# Altium project sterio_mic.PrjPcb
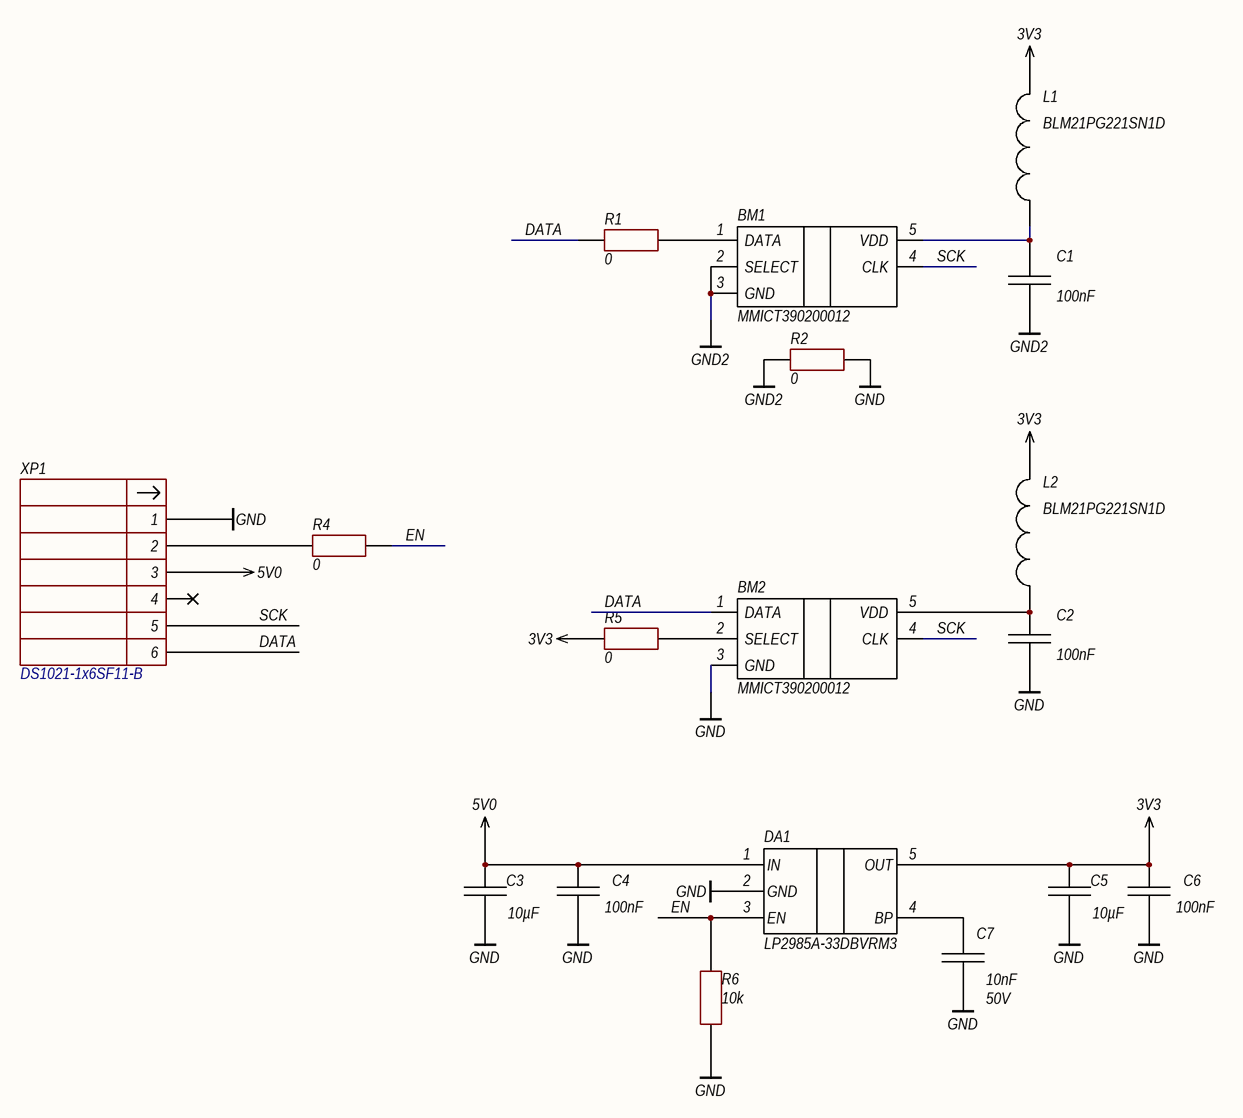
[diagram p0: sterio_mic MCU.SchDoc]
ApprovedBy: 5; Author: 1; CheckedBy: 2; NormInspection: 4; Organization: Encata; ProcessInspection: 3; ProjectNumber: 000123456; Title: Устройство; Title2str: устройство
1 sheet, 18 parts. Net scope: global (net labels, ports and power ports of the same name join across sheets).
Board file: sterio_mic PCB.PcbDoc

## Sheet sterio_mic MCU.SchDoc: Устройство
size 420 x 297 mm; DocumentNumber: 000123456 Э3; SheetNumber: 1; SheetTotal: 1; DocumentType: Схема электрическая принципиальная

### Parts
BM1  MMICT390200012  [5-Terminal LGA_CAV]
BM2  MMICT390200012  [5-Terminal LGA_CAV]
C1  Capacitance: 100nF  [CAPC0805_H0.95_N]  (hidden comment: CC0805KPX7R9BB104)
C2  Capacitance: 100nF  [CAPC0805_H0.95_N]  (hidden comment: CC0805KPX7R9BB104)
C3  Capacitance: 10µF  [CAPC0805_H1.45_N]  (hidden comment: CL21B106KOQNNNE)
C4  Capacitance: 100nF  [CAPC0805_H0.95_N]  (hidden comment: CC0805KPX7R9BB104)
C5  Capacitance: 10µF  [CAPC0805_H1.45_N]  (hidden comment: CL21B106KOQNNNE)
C6  Capacitance: 100nF  [CAPC0805_H0.95_N]  (hidden comment: CC0805KPX7R9BB104)
C7  Capacitance: 10nF  Voltage Rating: 50V  [CAPC0805_H0.95_N]  (hidden comment: CC0805JKNPO9BN103)
DA1  LP2985A-33DBVRM3  [SOT-23-5]
L1  BLM21PG221SN1D  [INDC0805_H1.25_N]
L2  BLM21PG221SN1D  [INDC0805_H1.25_N]
R1  Resistance: 0  [RESC0805_N]  (hidden comment: RC0805FR-070RL)
R2  Resistance: 0  [RESC0805_N]  (hidden comment: RC0805FR-070RL)
R4  Resistance: 0  [RESC0805_N]  (hidden comment: RC0805FR-070RL)
R5  Resistance: 0  [RESC0805_N]  (hidden comment: RC0805FR-070RL)
R6  Resistance: 10k  [RESC0805_N]  (hidden comment: RT0805BRB0710KL)
XP1  DS1021-1x6SF11-B  [PLS-6(DS-1021-1x6)]

### Nets
3V3: C5.1 C6.1 DA1.5(OUT) L1.2 L2.2 R5.1
5V0: C3.1 C4.1 DA1.1(IN) XP1.3
GND: BM2.3(GND) C2.2 C3.2 C4.2 C5.2 C6.2 C7.2 DA1.2(GND) R2.1 R6.1 XP1.1
GND2: BM1.2(SELECT) BM1.3(GND) C1.2 R2.2
DATA: BM2.1(DATA) R1.1 XP1.6
EN: DA1.3(EN) R4.1 R6.2
SCK: BM1.4(CLK) BM2.4(CLK) XP1.5
NetBM1_1: BM1.1(DATA) R1.2
NetBM1_5: BM1.5(VDD) C1.1 L1.1
NetBM2_2: BM2.2(SELECT) R5.2
NetBM2_5: BM2.5(VDD) C2.1 L2.1
NetC7_1: C7.1 DA1.4(BP)
NetR4_2: R4.2 XP1.2

Not connected (* = marked no-connect by the designer): XP1 4*

### Notes on the sheet
- Модификация
- Справ. №
- Подп. и дата
- Инв. № дубл.
- Взам. инв. №
- Разраб.
- Изм.
- Лист
- № докум.
- Подп.
- Дата
- Лит.
- Масса
- Масштаб
- Пров.
- Т.контр.
- Листов
- Инв. № подл.
- Утв.
- Н.контр.
- 2.106-A3
- Копировал
- Формат А3

### Library data of the parts
BM1 BM2 = CMP-SENS-0013-8: digital MEMS microphone; Manufacturer: TDK; Interface Type: PDM; Case/Package: LGA; Author: t.dorakh; HelpURL: https://static.chipdip.ru/lib/672/DOC011672161.pdf; Manufacturer Part Name: MMICT390200012
C1 C2 C4 C6 = CMP-CAP-CER-SMD-0001-5: 0805 100nF 50V ±10% X7R; Manufacturer: Yageo; Case Code (Metric): 2012; Dielectric: X7R; Length: 2mm; Voltage Rating: 50V; Lead Free: Yes; Series: СС; Depth: 850µm; Tolerance: 10%; Case Code (Imperial): 0805; Manufacturer Part Number: CC0805KPX7R9BB104; Case/Package: 0805; Author: m.seliadtsou; Width: 1.25mm; Height: 850µm; HelpURL: https://www.yageo.com/upload/media/product/products/datasheet/mlcc/UPY-GPHC_X7R_6.3V-to-50V_20.pdf
C3 C5 = CMP-CAP-CER-SMD-0082-5: 0805 10uF 16V ±10% X7R; Manufacturer: Samsung Electro-Mechanics; Author: m.boltromeyuk; Case Code (Imperial): 0805; Case Code (Metric): 2012; Case/Package: 0805; Depth: 1.25mm; Dielectric: X7R; Height: 1.25mm; HelpURL: https://weblib.samsungsem.com/mlcc/mlcc-ec-data-sheet.do?partNumber=CL21B106KOQNFN; Lead Free: Yes; Length: 2mm; Manufacturer Part Number: CL21B106KOQNNNE; Max Operating Temperature: 125°C; Min Operating Temperature: -55°C; Series: CL; Tolerance: 10%; Voltage Rating: 16V; Width: 1.25mm
C7 = CMP-CAP-CER-SMD-2016-4: 0805 10nF 50V ±5% NP0; Manufacturer: Yageo; Dielectric: C0G; Author: v.ivanchenko; Case Code (Imperial): 0805; Case Code (Metric): 2012; Case/Package: 0805; Depth: 1.25mm; Height: 1.25mm; HelpURL: http://www.yageo.ru/pdf/NP0_16V-to-100V.pdf; Lead Free: Yes; Length: 2mm; Manufacturer Part Number: CC0805JKNPO9BN103; Max Operating Temperature: 125°C; Min Operating Temperature: -55°C; Series: CC; Tolerance: 5%; Width: 1.25mm
DA1 = CMP-IC-POW_MGMT-LDO0051-6: 150-mA 16-V low-dropout (LDO) voltage regulator with high-accuracy 5-SOT-23 -40 to 125; Manufacturer: Texas Instruments; Manufacturer Lifecycle Status: ACTIVE; Max Input Voltage: 16V; Max Output Current: 300mA; Max Output Voltage: 3.3V; Min Input Voltage: 3.4V; Output Configuration: Positive; Output Current: 150mA; Output Type: Fixed; Dropout Voltage: 0.15V; Author: i.auramchyk; HelpUrl: https://www.ti.com/product/LP2985A?keyMatch=LP2985&tisearch=universal_search&usecase=partmatches; Manufacturer Part Number: LP2985A-33DBVRM3; Max Operating Temperature: 125°C; Min Operating Temperature: -40°C; Min Output Voltage: 3.3V; Mount: Surface mount; Case/Package: SOT-23; Height: 1.45mm; Length: 2.9mm; Lifecycle Status: Production; Pins: 5; RoHS: Compliant; Thickness: 1.2mm; Width: 1.6mm
L1 L2 = CMP-IND-0144-1: 9mΩ ±25% 22Ω@100MHz 6A 0805 Ferrite Beads ROHS; Manufacturer: Murata Electronics; Manufacturer Part Number: BLM21PG220SN1D; DC Resistance (DCR): 9m; Inductance: 0µH; Saturation Current: 0A; Test Frequency: 100MHz; Author: m.boltromeyuk; Case/Package: 0805; Depth: 1.25mm; Height: 850µm; HelpURL: https://pim.murata.com/en-global/pim/details/?productCategoryId=ferriteBeadInductortypefilter&partNum=BLM21PG220SN1%23; Lead Free: Lead Free; Length: 2mm; Max DC Current: 6A; Max Operating Temperature: 125°C; Min Operating Temperature: -55°C; Mount: Surface; RMS Current (Irms): 6A; RoHS Compliant: Yes; Series: BLM21; Termination: SMD/SMT; Tolerance: 25%; Width: 1.25mm
R1 R2 R4 R5 = CMP-RES-SMD-0511-6: RES SMD 0 OHM JUMPER 1% 1/8W 0805; Manufacturer: Yageo; Max Power Dissipation: 125mW; Voltage Rating: 150V; Author: M.S. Koval; Case/Package: 0805; HelpURL: https://www.yageo.com/upload/media/product/productsearch/datasheet/rchip/PYu-RC_Group_51_RoHS_L_11.pdf; Manufacturer Part Number: RC0805FR-070RL; Max Operating Temperature: 155°C; Min Operating Temperature: -55°C; Tolerance: 1%
R6 = CMP-RES-SMD-0973-2: RES SMD 10 KOHM 0.1% 1/8W 0805  10ppm; Manufacturer: Yageo; Max Power Dissipation: 125mW; Temperature Coefficient: ±10ppm/C°; Voltage Rating: 150V; Author: u.sushko; Case/Package: 0805; HelpURL: https://www.yageo.com/upload/media/product/productsearch/datasheet/rchip/PYu-RT_1-to-0.01_RoHS_L_14.pdf; Manufacturer Part Number: RT0805BRB0710KL; Max Operating Temperature: 155°C; Min Operating Temperature: -55°C; Tolerance: 0.1%
XP1 = CMP-CON-B2B-0048-3: 2.54mm, 6 pin, Male, 3A, Vertical mounting, CONNFLY; Contact Resistance: 20m; Gender: Non-Gendered; Number of Contacts: 6; Voltage Rating: 250V; Author: a.antipov; Color: Black; Contact Current Rating: 3A; Contact Gender: Male; Contact Plating: Gold; HelpURL: http://outer.connfly.group/static/upload/file/pdf/DS1021.pdf; Manufacturer: CONNFLY; Manufacturer Part Number: DS1021-1x6SF11-B; Max Operating Temperature: 105°C; Min Operating Temperature: -40°C; Mount: Through Hole; Orientation: Vertical; Pitch: 2.54mm